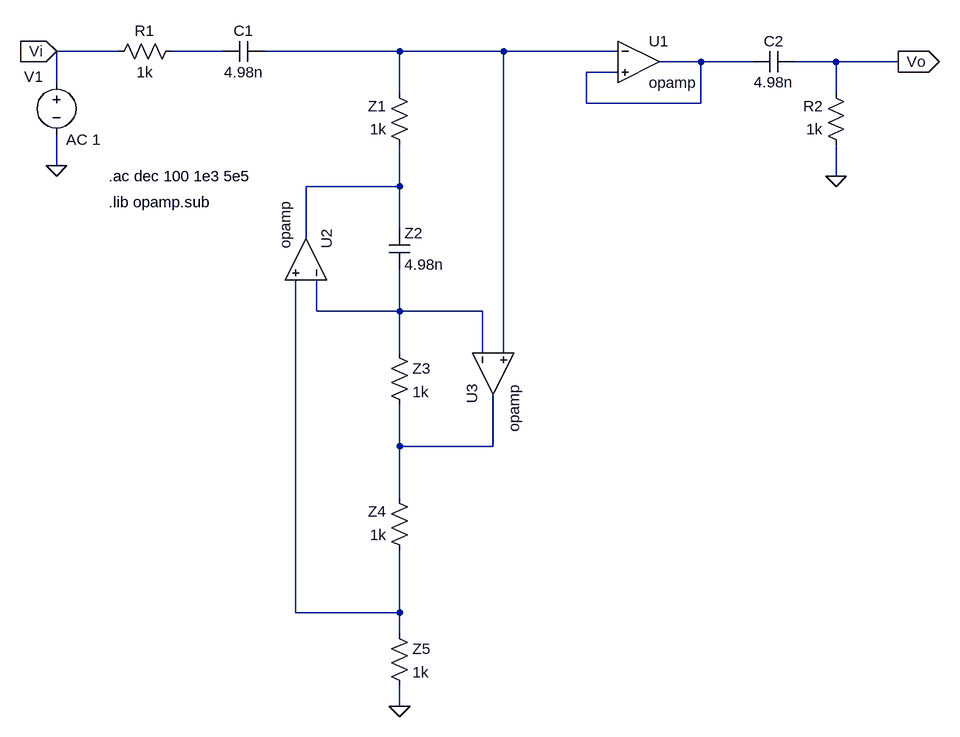
[diagram p0: schematic TS4_GIC.asc]
TS4_GIC.asc, the LTspice schematic file:
Version 4
SHEET 1 880 680
WIRE -1056 -784 -1152 -784
WIRE -896 -784 -976 -784
WIRE -624 -784 -832 -784
WIRE -464 -784 -624 -784
WIRE -288 -784 -464 -784
WIRE -160 -768 -224 -768
WIRE -80 -768 -160 -768
WIRE 48 -768 -16 -768
WIRE 144 -768 48 -768
WIRE -288 -752 -336 -752
WIRE -1152 -736 -1152 -784
WIRE -624 -720 -624 -784
WIRE 48 -720 48 -768
WIRE -336 -704 -336 -752
WIRE -160 -704 -160 -768
WIRE -160 -704 -336 -704
WIRE -1152 -608 -1152 -656
WIRE 48 -592 48 -640
WIRE -624 -576 -624 -640
WIRE -624 -576 -768 -576
WIRE -624 -512 -624 -576
WIRE -768 -496 -768 -576
WIRE -752 -384 -752 -432
WIRE -624 -384 -624 -448
WIRE -624 -384 -752 -384
WIRE -496 -384 -624 -384
WIRE -624 -320 -624 -384
WIRE -496 -320 -496 -384
WIRE -464 -320 -464 -784
WIRE -624 -176 -624 -240
WIRE -480 -176 -480 -256
WIRE -480 -176 -624 -176
WIRE -624 -96 -624 -176
WIRE -784 80 -784 -432
WIRE -624 80 -624 -16
WIRE -624 80 -784 80
WIRE -624 112 -624 80
WIRE -624 224 -624 192
FLAG -624 224 0
FLAG -1152 -608 0
FLAG -1152 -784 Vi
IOPIN -1152 -784 In
FLAG 144 -768 Vo
IOPIN 144 -768 Out
FLAG 48 -592 0
SYMBOL Opamps\\opamp -256 -832 R0
SYMATTR InstName U1
SYMBOL res 64 -624 R180
WINDOW 0 36 76 Left 2
WINDOW 3 36 40 Left 2
SYMATTR InstName R2
SYMATTR Value 1k
SYMBOL voltage -1152 -752 R0
WINDOW 0 -50 7 Left 2
WINDOW 123 15 104 Left 2
WINDOW 39 0 0 Left 2
SYMATTR InstName V1
SYMATTR Value2 AC 1
SYMATTR Value ""
SYMBOL cap -832 -800 R90
WINDOW 0 0 32 VBottom 2
WINDOW 3 32 32 VTop 2
SYMATTR InstName C1
SYMATTR Value 4.98n
SYMBOL res -960 -800 R90
WINDOW 0 0 56 VBottom 2
WINDOW 3 32 56 VTop 2
SYMATTR InstName R1
SYMATTR Value 1k
SYMBOL res -608 -624 R180
WINDOW 0 36 76 Left 2
WINDOW 3 36 40 Left 2
SYMATTR InstName Z1
SYMATTR Value 1k
SYMBOL Opamps\\opamp -704 -464 M270
SYMATTR InstName U2
SYMBOL Opamps\\opamp -544 -288 M90
SYMATTR InstName U3
SYMBOL res -608 0 R180
WINDOW 0 36 76 Left 2
WINDOW 3 36 40 Left 2
SYMATTR InstName Z4
SYMATTR Value 1k
SYMBOL cap -640 -512 R0
SYMATTR InstName Z2
SYMATTR Value 4.98n
SYMBOL res -640 -336 R0
SYMATTR InstName Z3
SYMATTR Value 1k
SYMBOL res -640 96 R0
SYMATTR InstName Z5
SYMATTR Value 1k
SYMBOL cap -16 -784 R90
WINDOW 0 0 32 VBottom 2
WINDOW 3 32 32 VTop 2
SYMATTR InstName C2
SYMATTR Value 4.98n
TEXT -1072 -592 Left 2 !.ac dec 100 1e3 5e5
TEXT -1072 -552 Left 2 !.lib opamp.sub

The netlist it stands for:
* TS4_GIC.asc
XU1 N002 N003 N003 opamp Aol=100K GBW=10Meg  ; pins invin noninvin out
R2 0 Vo 1k
V1 Vi 0 AC 1
C1 N002 N001 4.98n
R1 N001 Vi 1k
R§Z1 N004 N002 1k
XU2 N005 N007 N004 opamp Aol=100K GBW=10Meg  ; pins invin noninvin out
XU3 N005 N002 N006 opamp Aol=100K GBW=10Meg  ; pins invin noninvin out
R§Z4 N007 N006 1k
C§Z2 N004 N005 4.98n
R§Z3 N005 N006 1k
R§Z5 N007 0 1k
C2 Vo N003 4.98n
.ac dec 100 1e3 5e5
.lib opamp.sub
.backanno
.end